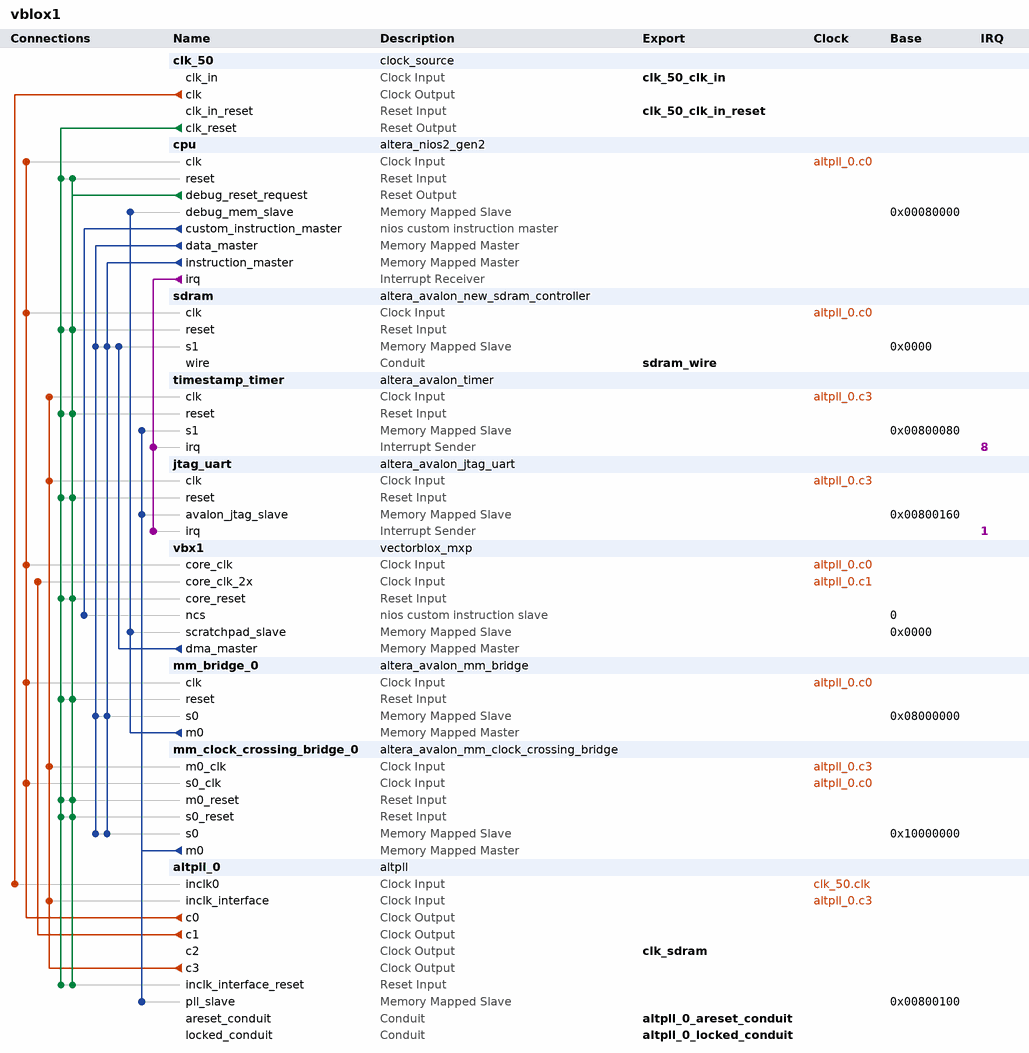
[diagram p0: system contents]
# Platform Designer (Qsys) system vblox1, Cyclone IV E EP4CE115F29C7
# Parameters at their usual value, and those the tool derives, are not listed.
package require -exact qsys 17.1
create_system vblox1
set_project_property DEVICE_FAMILY {Cyclone IV E}
set_project_property DEVICE EP4CE115F29C7

add_instance clk_50 clock_source 17.1
set_instance_parameter_value clk_50 clockFrequency 50000000

add_instance cpu altera_nios2_gen2 17.1
set_instance_parameter_value cpu dcache_bursts true
set_instance_parameter_value cpu dcache_size 4096
set_instance_parameter_value cpu exceptionSlave sdram.s1
set_instance_parameter_value cpu icache_burstType Sequential
set_instance_parameter_value cpu icache_size 8192
set_instance_parameter_value cpu impl Fast
set_instance_parameter_value cpu resetSlave sdram.s1
set_instance_parameter_value cpu setting_activateTrace true

add_instance sdram altera_avalon_new_sdram_controller 17.1
set_instance_parameter_value sdram TAC 5.5
set_instance_parameter_value sdram TRCD 20.0
set_instance_parameter_value sdram TRP 20.0
set_instance_parameter_value sdram casLatency 3
set_instance_parameter_value sdram columnWidth 10
set_instance_parameter_value sdram dataWidth 32
set_instance_parameter_value sdram generateSimulationModel true
set_instance_parameter_value sdram model custom
set_instance_parameter_value sdram numberOfBanks 4
set_instance_parameter_value sdram numberOfChipSelects 1
set_instance_parameter_value sdram powerUpDelay 100.0
set_instance_parameter_value sdram refreshPeriod 15.625
set_instance_parameter_value sdram rowWidth 13

add_instance timestamp_timer altera_avalon_timer 17.1
set_instance_parameter_value timestamp_timer counterSize 64
set_instance_parameter_value timestamp_timer period 1
set_instance_parameter_value timestamp_timer periodUnits MSEC

add_instance jtag_uart altera_avalon_jtag_uart 17.1
set_instance_parameter_value jtag_uart readBufferDepth 256
set_instance_parameter_value jtag_uart readIRQThreshold 4
set_instance_parameter_value jtag_uart simInteractiveOptions INTERACTIVE_ASCII_OUTPUT
set_instance_parameter_value jtag_uart writeBufferDepth 256
set_instance_parameter_value jtag_uart writeIRQThreshold 4

add_instance vbx1 vectorblox_mxp 1.1
set_instance_parameter_value vbx1 BEATS_PER_BURST 8
set_instance_parameter_value vbx1 CI_CLK_DOMAIN 0
set_instance_parameter_value vbx1 CI_CLK_RATE 0
set_instance_parameter_value vbx1 CORE_CLK_2X_DOMAIN 5
set_instance_parameter_value vbx1 CORE_CLK_2X_RATE 240000000
set_instance_parameter_value vbx1 CORE_CLK_DOMAIN 4
set_instance_parameter_value vbx1 CORE_CLK_RATE 120000000
set_instance_parameter_value vbx1 FIXED_POINT_SUPPORT 1
set_instance_parameter_value vbx1 INSTR_ADDR_WIDTH 6
set_instance_parameter_value vbx1 INSTR_PORT_CHOICE 1
set_instance_parameter_value vbx1 INSTR_PORT_ID_WIDTH 12
set_instance_parameter_value vbx1 MAX_MASKED_WAVES 256
set_instance_parameter_value vbx1 MAX_VCI_DEPTH_WITHOUT_FLUSH 2
set_instance_parameter_value vbx1 MEMORY_WIDTH_LANES 1
set_instance_parameter_value vbx1 MIN_MULTIPLIER_HW 0
set_instance_parameter_value vbx1 MULFXP_BYTE_FRACTION_BITS 4
set_instance_parameter_value vbx1 MULFXP_HALF_FRACTION_BITS 15
set_instance_parameter_value vbx1 MULFXP_WORD_FRACTION_BITS 25
set_instance_parameter_value vbx1 SCRATCHPAD_KB 8
set_instance_parameter_value vbx1 SLAVE_WIDTH_LANES 1
set_instance_parameter_value vbx1 UNIQUE_ID {$${FILENAME}_vbx1}
set_instance_parameter_value vbx1 VCI_0_FUNCTIONS 1
set_instance_parameter_value vbx1 VCI_0_FUNCTION_0_DEPTH 0
set_instance_parameter_value vbx1 VCI_0_FUNCTION_10_DEPTH 0
set_instance_parameter_value vbx1 VCI_0_FUNCTION_11_DEPTH 0
set_instance_parameter_value vbx1 VCI_0_FUNCTION_12_DEPTH 0
set_instance_parameter_value vbx1 VCI_0_FUNCTION_13_DEPTH 0
set_instance_parameter_value vbx1 VCI_0_FUNCTION_14_DEPTH 0
set_instance_parameter_value vbx1 VCI_0_FUNCTION_15_DEPTH 0
set_instance_parameter_value vbx1 VCI_0_FUNCTION_1_DEPTH 0
set_instance_parameter_value vbx1 VCI_0_FUNCTION_2_DEPTH 0
set_instance_parameter_value vbx1 VCI_0_FUNCTION_3_DEPTH 0
set_instance_parameter_value vbx1 VCI_0_FUNCTION_4_DEPTH 0
set_instance_parameter_value vbx1 VCI_0_FUNCTION_5_DEPTH 0
set_instance_parameter_value vbx1 VCI_0_FUNCTION_6_DEPTH 0
set_instance_parameter_value vbx1 VCI_0_FUNCTION_7_DEPTH 0
set_instance_parameter_value vbx1 VCI_0_FUNCTION_8_DEPTH 0
set_instance_parameter_value vbx1 VCI_0_FUNCTION_9_DEPTH 0
set_instance_parameter_value vbx1 VCI_0_LANES 1
set_instance_parameter_value vbx1 VCI_0_MODIFIES_DEST_ADDR 0
set_instance_parameter_value vbx1 VCI_0_OPCODE_START 0
set_instance_parameter_value vbx1 VCI_0_UID -1
set_instance_parameter_value vbx1 VCI_10_FUNCTIONS 1
set_instance_parameter_value vbx1 VCI_10_FUNCTION_0_DEPTH 0
set_instance_parameter_value vbx1 VCI_10_FUNCTION_1_DEPTH 0
set_instance_parameter_value vbx1 VCI_10_FUNCTION_2_DEPTH 0
set_instance_parameter_value vbx1 VCI_10_FUNCTION_3_DEPTH 0
set_instance_parameter_value vbx1 VCI_10_FUNCTION_4_DEPTH 0
set_instance_parameter_value vbx1 VCI_10_FUNCTION_5_DEPTH 0
set_instance_parameter_value vbx1 VCI_10_LANES 1
set_instance_parameter_value vbx1 VCI_10_MODIFIES_DEST_ADDR 0
set_instance_parameter_value vbx1 VCI_10_OPCODE_START 10
set_instance_parameter_value vbx1 VCI_10_UID -1
set_instance_parameter_value vbx1 VCI_11_FUNCTIONS 1
set_instance_parameter_value vbx1 VCI_11_FUNCTION_0_DEPTH 0
set_instance_parameter_value vbx1 VCI_11_FUNCTION_1_DEPTH 0
set_instance_parameter_value vbx1 VCI_11_FUNCTION_2_DEPTH 0
set_instance_parameter_value vbx1 VCI_11_FUNCTION_3_DEPTH 0
set_instance_parameter_value vbx1 VCI_11_FUNCTION_4_DEPTH 0
set_instance_parameter_value vbx1 VCI_11_LANES 1
set_instance_parameter_value vbx1 VCI_11_MODIFIES_DEST_ADDR 0
set_instance_parameter_value vbx1 VCI_11_OPCODE_START 11
set_instance_parameter_value vbx1 VCI_11_UID -1
set_instance_parameter_value vbx1 VCI_12_FUNCTIONS 1
set_instance_parameter_value vbx1 VCI_12_FUNCTION_0_DEPTH 0
set_instance_parameter_value vbx1 VCI_12_FUNCTION_1_DEPTH 0
set_instance_parameter_value vbx1 VCI_12_FUNCTION_2_DEPTH 0
set_instance_parameter_value vbx1 VCI_12_FUNCTION_3_DEPTH 0
set_instance_parameter_value vbx1 VCI_12_LANES 1
set_instance_parameter_value vbx1 VCI_12_MODIFIES_DEST_ADDR 0
set_instance_parameter_value vbx1 VCI_12_OPCODE_START 12
set_instance_parameter_value vbx1 VCI_12_UID -1
set_instance_parameter_value vbx1 VCI_13_FUNCTIONS 1
set_instance_parameter_value vbx1 VCI_13_FUNCTION_0_DEPTH 0
set_instance_parameter_value vbx1 VCI_13_FUNCTION_1_DEPTH 0
set_instance_parameter_value vbx1 VCI_13_FUNCTION_2_DEPTH 0
set_instance_parameter_value vbx1 VCI_13_LANES 1
set_instance_parameter_value vbx1 VCI_13_MODIFIES_DEST_ADDR 0
set_instance_parameter_value vbx1 VCI_13_OPCODE_START 13
set_instance_parameter_value vbx1 VCI_13_UID -1
set_instance_parameter_value vbx1 VCI_14_FUNCTIONS 1
set_instance_parameter_value vbx1 VCI_14_FUNCTION_0_DEPTH 0
set_instance_parameter_value vbx1 VCI_14_FUNCTION_1_DEPTH 0
set_instance_parameter_value vbx1 VCI_14_LANES 1
set_instance_parameter_value vbx1 VCI_14_MODIFIES_DEST_ADDR 0
set_instance_parameter_value vbx1 VCI_14_OPCODE_START 14
set_instance_parameter_value vbx1 VCI_14_UID -1
set_instance_parameter_value vbx1 VCI_15_FUNCTIONS 1
set_instance_parameter_value vbx1 VCI_15_FUNCTION_0_DEPTH 0
set_instance_parameter_value vbx1 VCI_15_LANES 1
set_instance_parameter_value vbx1 VCI_15_MODIFIES_DEST_ADDR 0
set_instance_parameter_value vbx1 VCI_15_OPCODE_START 15
set_instance_parameter_value vbx1 VCI_15_UID -1
set_instance_parameter_value vbx1 VCI_1_FUNCTIONS 1
set_instance_parameter_value vbx1 VCI_1_FUNCTION_0_DEPTH 0
set_instance_parameter_value vbx1 VCI_1_FUNCTION_10_DEPTH 0
set_instance_parameter_value vbx1 VCI_1_FUNCTION_11_DEPTH 0
set_instance_parameter_value vbx1 VCI_1_FUNCTION_12_DEPTH 0
set_instance_parameter_value vbx1 VCI_1_FUNCTION_13_DEPTH 0
set_instance_parameter_value vbx1 VCI_1_FUNCTION_14_DEPTH 0
set_instance_parameter_value vbx1 VCI_1_FUNCTION_1_DEPTH 0
set_instance_parameter_value vbx1 VCI_1_FUNCTION_2_DEPTH 0
set_instance_parameter_value vbx1 VCI_1_FUNCTION_3_DEPTH 0
set_instance_parameter_value vbx1 VCI_1_FUNCTION_4_DEPTH 0
set_instance_parameter_value vbx1 VCI_1_FUNCTION_5_DEPTH 0
set_instance_parameter_value vbx1 VCI_1_FUNCTION_6_DEPTH 0
set_instance_parameter_value vbx1 VCI_1_FUNCTION_7_DEPTH 0
set_instance_parameter_value vbx1 VCI_1_FUNCTION_8_DEPTH 0
set_instance_parameter_value vbx1 VCI_1_FUNCTION_9_DEPTH 0
set_instance_parameter_value vbx1 VCI_1_LANES 1
set_instance_parameter_value vbx1 VCI_1_MODIFIES_DEST_ADDR 0
set_instance_parameter_value vbx1 VCI_1_OPCODE_START 1
set_instance_parameter_value vbx1 VCI_1_UID -1
set_instance_parameter_value vbx1 VCI_2_FUNCTIONS 1
set_instance_parameter_value vbx1 VCI_2_FUNCTION_0_DEPTH 0
set_instance_parameter_value vbx1 VCI_2_FUNCTION_10_DEPTH 0
set_instance_parameter_value vbx1 VCI_2_FUNCTION_11_DEPTH 0
set_instance_parameter_value vbx1 VCI_2_FUNCTION_12_DEPTH 0
set_instance_parameter_value vbx1 VCI_2_FUNCTION_13_DEPTH 0
set_instance_parameter_value vbx1 VCI_2_FUNCTION_1_DEPTH 0
set_instance_parameter_value vbx1 VCI_2_FUNCTION_2_DEPTH 0
set_instance_parameter_value vbx1 VCI_2_FUNCTION_3_DEPTH 0
set_instance_parameter_value vbx1 VCI_2_FUNCTION_4_DEPTH 0
set_instance_parameter_value vbx1 VCI_2_FUNCTION_5_DEPTH 0
set_instance_parameter_value vbx1 VCI_2_FUNCTION_6_DEPTH 0
set_instance_parameter_value vbx1 VCI_2_FUNCTION_7_DEPTH 0
set_instance_parameter_value vbx1 VCI_2_FUNCTION_8_DEPTH 0
set_instance_parameter_value vbx1 VCI_2_FUNCTION_9_DEPTH 0
set_instance_parameter_value vbx1 VCI_2_LANES 1
set_instance_parameter_value vbx1 VCI_2_MODIFIES_DEST_ADDR 0
set_instance_parameter_value vbx1 VCI_2_OPCODE_START 2
set_instance_parameter_value vbx1 VCI_2_UID -1
set_instance_parameter_value vbx1 VCI_3_FUNCTIONS 1
set_instance_parameter_value vbx1 VCI_3_FUNCTION_0_DEPTH 0
set_instance_parameter_value vbx1 VCI_3_FUNCTION_10_DEPTH 0
set_instance_parameter_value vbx1 VCI_3_FUNCTION_11_DEPTH 0
set_instance_parameter_value vbx1 VCI_3_FUNCTION_12_DEPTH 0
set_instance_parameter_value vbx1 VCI_3_FUNCTION_1_DEPTH 0
set_instance_parameter_value vbx1 VCI_3_FUNCTION_2_DEPTH 0
set_instance_parameter_value vbx1 VCI_3_FUNCTION_3_DEPTH 0
set_instance_parameter_value vbx1 VCI_3_FUNCTION_4_DEPTH 0
set_instance_parameter_value vbx1 VCI_3_FUNCTION_5_DEPTH 0
set_instance_parameter_value vbx1 VCI_3_FUNCTION_6_DEPTH 0
set_instance_parameter_value vbx1 VCI_3_FUNCTION_7_DEPTH 0
set_instance_parameter_value vbx1 VCI_3_FUNCTION_8_DEPTH 0
set_instance_parameter_value vbx1 VCI_3_FUNCTION_9_DEPTH 0
set_instance_parameter_value vbx1 VCI_3_LANES 1
set_instance_parameter_value vbx1 VCI_3_MODIFIES_DEST_ADDR 0
set_instance_parameter_value vbx1 VCI_3_OPCODE_START 3
set_instance_parameter_value vbx1 VCI_3_UID -1
set_instance_parameter_value vbx1 VCI_4_FUNCTIONS 1
set_instance_parameter_value vbx1 VCI_4_FUNCTION_0_DEPTH 0
set_instance_parameter_value vbx1 VCI_4_FUNCTION_10_DEPTH 0
set_instance_parameter_value vbx1 VCI_4_FUNCTION_11_DEPTH 0
set_instance_parameter_value vbx1 VCI_4_FUNCTION_1_DEPTH 0
set_instance_parameter_value vbx1 VCI_4_FUNCTION_2_DEPTH 0
set_instance_parameter_value vbx1 VCI_4_FUNCTION_3_DEPTH 0
set_instance_parameter_value vbx1 VCI_4_FUNCTION_4_DEPTH 0
set_instance_parameter_value vbx1 VCI_4_FUNCTION_5_DEPTH 0
set_instance_parameter_value vbx1 VCI_4_FUNCTION_6_DEPTH 0
set_instance_parameter_value vbx1 VCI_4_FUNCTION_7_DEPTH 0
set_instance_parameter_value vbx1 VCI_4_FUNCTION_8_DEPTH 0
set_instance_parameter_value vbx1 VCI_4_FUNCTION_9_DEPTH 0
set_instance_parameter_value vbx1 VCI_4_LANES 1
set_instance_parameter_value vbx1 VCI_4_MODIFIES_DEST_ADDR 0
set_instance_parameter_value vbx1 VCI_4_OPCODE_START 4
set_instance_parameter_value vbx1 VCI_4_UID -1
set_instance_parameter_value vbx1 VCI_5_FUNCTIONS 1
set_instance_parameter_value vbx1 VCI_5_FUNCTION_0_DEPTH 0
set_instance_parameter_value vbx1 VCI_5_FUNCTION_10_DEPTH 0
set_instance_parameter_value vbx1 VCI_5_FUNCTION_1_DEPTH 0
set_instance_parameter_value vbx1 VCI_5_FUNCTION_2_DEPTH 0
set_instance_parameter_value vbx1 VCI_5_FUNCTION_3_DEPTH 0
set_instance_parameter_value vbx1 VCI_5_FUNCTION_4_DEPTH 0
set_instance_parameter_value vbx1 VCI_5_FUNCTION_5_DEPTH 0
set_instance_parameter_value vbx1 VCI_5_FUNCTION_6_DEPTH 0
set_instance_parameter_value vbx1 VCI_5_FUNCTION_7_DEPTH 0
set_instance_parameter_value vbx1 VCI_5_FUNCTION_8_DEPTH 0
set_instance_parameter_value vbx1 VCI_5_FUNCTION_9_DEPTH 0
set_instance_parameter_value vbx1 VCI_5_LANES 1
set_instance_parameter_value vbx1 VCI_5_MODIFIES_DEST_ADDR 0
set_instance_parameter_value vbx1 VCI_5_OPCODE_START 5
set_instance_parameter_value vbx1 VCI_5_UID -1
set_instance_parameter_value vbx1 VCI_6_FUNCTIONS 1
set_instance_parameter_value vbx1 VCI_6_FUNCTION_0_DEPTH 0
set_instance_parameter_value vbx1 VCI_6_FUNCTION_1_DEPTH 0
set_instance_parameter_value vbx1 VCI_6_FUNCTION_2_DEPTH 0
set_instance_parameter_value vbx1 VCI_6_FUNCTION_3_DEPTH 0
set_instance_parameter_value vbx1 VCI_6_FUNCTION_4_DEPTH 0
set_instance_parameter_value vbx1 VCI_6_FUNCTION_5_DEPTH 0
set_instance_parameter_value vbx1 VCI_6_FUNCTION_6_DEPTH 0
set_instance_parameter_value vbx1 VCI_6_FUNCTION_7_DEPTH 0
set_instance_parameter_value vbx1 VCI_6_FUNCTION_8_DEPTH 0
set_instance_parameter_value vbx1 VCI_6_FUNCTION_9_DEPTH 0
set_instance_parameter_value vbx1 VCI_6_LANES 1
set_instance_parameter_value vbx1 VCI_6_MODIFIES_DEST_ADDR 0
set_instance_parameter_value vbx1 VCI_6_OPCODE_START 6
set_instance_parameter_value vbx1 VCI_6_UID -1
set_instance_parameter_value vbx1 VCI_7_FUNCTIONS 1
set_instance_parameter_value vbx1 VCI_7_FUNCTION_0_DEPTH 0
set_instance_parameter_value vbx1 VCI_7_FUNCTION_1_DEPTH 0
set_instance_parameter_value vbx1 VCI_7_FUNCTION_2_DEPTH 0
set_instance_parameter_value vbx1 VCI_7_FUNCTION_3_DEPTH 0
set_instance_parameter_value vbx1 VCI_7_FUNCTION_4_DEPTH 0
set_instance_parameter_value vbx1 VCI_7_FUNCTION_5_DEPTH 0
set_instance_parameter_value vbx1 VCI_7_FUNCTION_6_DEPTH 0
set_instance_parameter_value vbx1 VCI_7_FUNCTION_7_DEPTH 0
set_instance_parameter_value vbx1 VCI_7_FUNCTION_8_DEPTH 0
set_instance_parameter_value vbx1 VCI_7_LANES 1
set_instance_parameter_value vbx1 VCI_7_MODIFIES_DEST_ADDR 0
set_instance_parameter_value vbx1 VCI_7_OPCODE_START 7
set_instance_parameter_value vbx1 VCI_7_UID -1
set_instance_parameter_value vbx1 VCI_8_FUNCTIONS 1
set_instance_parameter_value vbx1 VCI_8_FUNCTION_0_DEPTH 0
set_instance_parameter_value vbx1 VCI_8_FUNCTION_1_DEPTH 0
set_instance_parameter_value vbx1 VCI_8_FUNCTION_2_DEPTH 0
set_instance_parameter_value vbx1 VCI_8_FUNCTION_3_DEPTH 0
set_instance_parameter_value vbx1 VCI_8_FUNCTION_4_DEPTH 0
set_instance_parameter_value vbx1 VCI_8_FUNCTION_5_DEPTH 0
set_instance_parameter_value vbx1 VCI_8_FUNCTION_6_DEPTH 0
set_instance_parameter_value vbx1 VCI_8_FUNCTION_7_DEPTH 0
set_instance_parameter_value vbx1 VCI_8_LANES 1
set_instance_parameter_value vbx1 VCI_8_MODIFIES_DEST_ADDR 0
set_instance_parameter_value vbx1 VCI_8_OPCODE_START 8
set_instance_parameter_value vbx1 VCI_8_UID -1
set_instance_parameter_value vbx1 VCI_9_FUNCTIONS 1
set_instance_parameter_value vbx1 VCI_9_FUNCTION_0_DEPTH 0
set_instance_parameter_value vbx1 VCI_9_FUNCTION_1_DEPTH 0
set_instance_parameter_value vbx1 VCI_9_FUNCTION_2_DEPTH 0
set_instance_parameter_value vbx1 VCI_9_FUNCTION_3_DEPTH 0
set_instance_parameter_value vbx1 VCI_9_FUNCTION_4_DEPTH 0
set_instance_parameter_value vbx1 VCI_9_FUNCTION_5_DEPTH 0
set_instance_parameter_value vbx1 VCI_9_FUNCTION_6_DEPTH 0
set_instance_parameter_value vbx1 VCI_9_LANES 1
set_instance_parameter_value vbx1 VCI_9_MODIFIES_DEST_ADDR 0
set_instance_parameter_value vbx1 VCI_9_OPCODE_START 9
set_instance_parameter_value vbx1 VCI_9_UID -1
set_instance_parameter_value vbx1 VECTOR_CUSTOM_INSTRUCTIONS 0
set_instance_parameter_value vbx1 VECTOR_LANES 1

add_instance mm_bridge_0 altera_avalon_mm_bridge 17.1
set_instance_parameter_value mm_bridge_0 ADDRESS_UNITS SYMBOLS
set_instance_parameter_value mm_bridge_0 ADDRESS_WIDTH 27
set_instance_parameter_value mm_bridge_0 DATA_WIDTH 32
set_instance_parameter_value mm_bridge_0 MAX_BURST_SIZE 4
set_instance_parameter_value mm_bridge_0 MAX_PENDING_RESPONSES 4
set_instance_parameter_value mm_bridge_0 USE_AUTO_ADDRESS_WIDTH 0

add_instance mm_clock_crossing_bridge_0 altera_avalon_mm_clock_crossing_bridge 17.1
set_instance_parameter_value mm_clock_crossing_bridge_0 ADDRESS_WIDTH 27
set_instance_parameter_value mm_clock_crossing_bridge_0 COMMAND_FIFO_DEPTH 2
set_instance_parameter_value mm_clock_crossing_bridge_0 DATA_WIDTH 32
set_instance_parameter_value mm_clock_crossing_bridge_0 MASTER_SYNC_DEPTH 2
set_instance_parameter_value mm_clock_crossing_bridge_0 MAX_BURST_SIZE 1
set_instance_parameter_value mm_clock_crossing_bridge_0 RESPONSE_FIFO_DEPTH 2
set_instance_parameter_value mm_clock_crossing_bridge_0 SLAVE_SYNC_DEPTH 2
set_instance_parameter_value mm_clock_crossing_bridge_0 USE_AUTO_ADDRESS_WIDTH 0

add_instance altpll_0 altpll 17.1
set_instance_parameter_value altpll_0 AVALON_USE_SEPARATE_SYSCLK YES
set_instance_parameter_value altpll_0 CLK0_DIVIDE_BY 5
set_instance_parameter_value altpll_0 CLK0_MULTIPLY_BY 12
set_instance_parameter_value altpll_0 CLK1_DIVIDE_BY 5
set_instance_parameter_value altpll_0 CLK1_DUTY_CYCLE 50
set_instance_parameter_value altpll_0 CLK1_MULTIPLY_BY 24
set_instance_parameter_value altpll_0 CLK1_PHASE_SHIFT 0
set_instance_parameter_value altpll_0 CLK2_DIVIDE_BY 5
set_instance_parameter_value altpll_0 CLK2_DUTY_CYCLE 50
set_instance_parameter_value altpll_0 CLK2_MULTIPLY_BY 12
set_instance_parameter_value altpll_0 CLK2_PHASE_SHIFT -35
set_instance_parameter_value altpll_0 CLK3_DIVIDE_BY 5
set_instance_parameter_value altpll_0 CLK3_DUTY_CYCLE 50
set_instance_parameter_value altpll_0 CLK3_MULTIPLY_BY 4
set_instance_parameter_value altpll_0 CLK3_PHASE_SHIFT 0
set_instance_parameter_value altpll_0 INCLK0_INPUT_FREQUENCY 20000
set_instance_parameter_value altpll_0 PORT_ARESET PORT_USED
set_instance_parameter_value altpll_0 PORT_LOCKED PORT_USED
set_instance_parameter_value altpll_0 PORT_clk1 PORT_USED
set_instance_parameter_value altpll_0 PORT_clk2 PORT_USED
set_instance_parameter_value altpll_0 PORT_clk3 PORT_USED

# connections
add_connection altpll_0.c0 cpu.clk clock
add_connection altpll_0.c0 mm_bridge_0.clk clock
add_connection altpll_0.c0 mm_clock_crossing_bridge_0.s0_clk clock
add_connection altpll_0.c0 sdram.clk clock
add_connection altpll_0.c0 vbx1.core_clk clock
add_connection altpll_0.c1 vbx1.core_clk_2x clock
add_connection altpll_0.c3 altpll_0.inclk_interface clock
add_connection altpll_0.c3 jtag_uart.clk clock
add_connection altpll_0.c3 mm_clock_crossing_bridge_0.m0_clk clock
add_connection altpll_0.c3 timestamp_timer.clk clock
add_connection clk_50.clk altpll_0.inclk0 clock
add_connection clk_50.clk_reset altpll_0.inclk_interface_reset reset
add_connection clk_50.clk_reset cpu.reset reset
add_connection clk_50.clk_reset jtag_uart.reset reset
add_connection clk_50.clk_reset mm_bridge_0.reset reset
add_connection clk_50.clk_reset mm_clock_crossing_bridge_0.m0_reset reset
add_connection clk_50.clk_reset mm_clock_crossing_bridge_0.s0_reset reset
add_connection clk_50.clk_reset sdram.reset reset
add_connection clk_50.clk_reset timestamp_timer.reset reset
add_connection clk_50.clk_reset vbx1.core_reset reset
add_connection cpu.debug_reset_request altpll_0.inclk_interface_reset reset
add_connection cpu.debug_reset_request cpu.reset reset
add_connection cpu.debug_reset_request jtag_uart.reset reset
add_connection cpu.debug_reset_request mm_bridge_0.reset reset
add_connection cpu.debug_reset_request mm_clock_crossing_bridge_0.m0_reset reset
add_connection cpu.debug_reset_request mm_clock_crossing_bridge_0.s0_reset reset
add_connection cpu.debug_reset_request sdram.reset reset
add_connection cpu.debug_reset_request timestamp_timer.reset reset
add_connection cpu.debug_reset_request vbx1.core_reset reset
add_connection cpu.data_master mm_bridge_0.s0 avalon
set_connection_parameter_value cpu.data_master/mm_bridge_0.s0 baseAddress 0x08000000
add_connection cpu.data_master mm_clock_crossing_bridge_0.s0 avalon
set_connection_parameter_value cpu.data_master/mm_clock_crossing_bridge_0.s0 baseAddress 0x10000000
add_connection cpu.data_master sdram.s1 avalon
set_connection_parameter_value cpu.data_master/sdram.s1 baseAddress 0x0000
add_connection cpu.instruction_master mm_bridge_0.s0 avalon
set_connection_parameter_value cpu.instruction_master/mm_bridge_0.s0 baseAddress 0x08000000
add_connection cpu.instruction_master mm_clock_crossing_bridge_0.s0 avalon
set_connection_parameter_value cpu.instruction_master/mm_clock_crossing_bridge_0.s0 baseAddress 0x10000000
add_connection cpu.instruction_master sdram.s1 avalon
set_connection_parameter_value cpu.instruction_master/sdram.s1 baseAddress 0x0000
add_connection mm_bridge_0.m0 cpu.debug_mem_slave avalon
set_connection_parameter_value mm_bridge_0.m0/cpu.debug_mem_slave baseAddress 0x00080000
add_connection mm_bridge_0.m0 vbx1.scratchpad_slave avalon
set_connection_parameter_value mm_bridge_0.m0/vbx1.scratchpad_slave baseAddress 0x0000
add_connection mm_clock_crossing_bridge_0.m0 altpll_0.pll_slave avalon
set_connection_parameter_value mm_clock_crossing_bridge_0.m0/altpll_0.pll_slave baseAddress 0x00800100
add_connection mm_clock_crossing_bridge_0.m0 jtag_uart.avalon_jtag_slave avalon
set_connection_parameter_value mm_clock_crossing_bridge_0.m0/jtag_uart.avalon_jtag_slave baseAddress 0x00800160
add_connection mm_clock_crossing_bridge_0.m0 timestamp_timer.s1 avalon
set_connection_parameter_value mm_clock_crossing_bridge_0.m0/timestamp_timer.s1 baseAddress 0x00800080
add_connection vbx1.dma_master sdram.s1 avalon
set_connection_parameter_value vbx1.dma_master/sdram.s1 baseAddress 0x0000
add_connection cpu.irq jtag_uart.irq interrupt
set_connection_parameter_value cpu.irq/jtag_uart.irq irqNumber 1
add_connection cpu.irq timestamp_timer.irq interrupt
set_connection_parameter_value cpu.irq/timestamp_timer.irq irqNumber 8
add_connection cpu.custom_instruction_master vbx1.ncs nios_custom_instruction
set_connection_parameter_value cpu.custom_instruction_master/vbx1.ncs CIName vectorblox_ncs_shim_0
set_connection_parameter_value cpu.custom_instruction_master/vbx1.ncs baseAddress 0

# exported interfaces
add_interface altpll_0_areset_conduit conduit end
set_interface_property altpll_0_areset_conduit EXPORT_OF altpll_0.areset_conduit
add_interface altpll_0_locked_conduit conduit end
set_interface_property altpll_0_locked_conduit EXPORT_OF altpll_0.locked_conduit
add_interface clk_50_clk_in clock sink
set_interface_property clk_50_clk_in EXPORT_OF clk_50.clk_in
add_interface clk_50_clk_in_reset reset sink
set_interface_property clk_50_clk_in_reset EXPORT_OF clk_50.clk_in_reset
add_interface clk_sdram clock source
set_interface_property clk_sdram EXPORT_OF altpll_0.c2
add_interface sdram_wire conduit end
set_interface_property sdram_wire EXPORT_OF sdram.wire

set_interconnect_requirement {$system} qsys_mm.clockCrossingAdapter AUTO
set_interconnect_requirement {$system} qsys_mm.maxAdditionalLatency 4

save_system vblox1.qsys
